# Altium schematic sheet Sensors.SchDoc: Sensors
size A4; DrawnBy: Alex Dyer; Revision: A; SheetNumber: 4; SheetTotal: 5
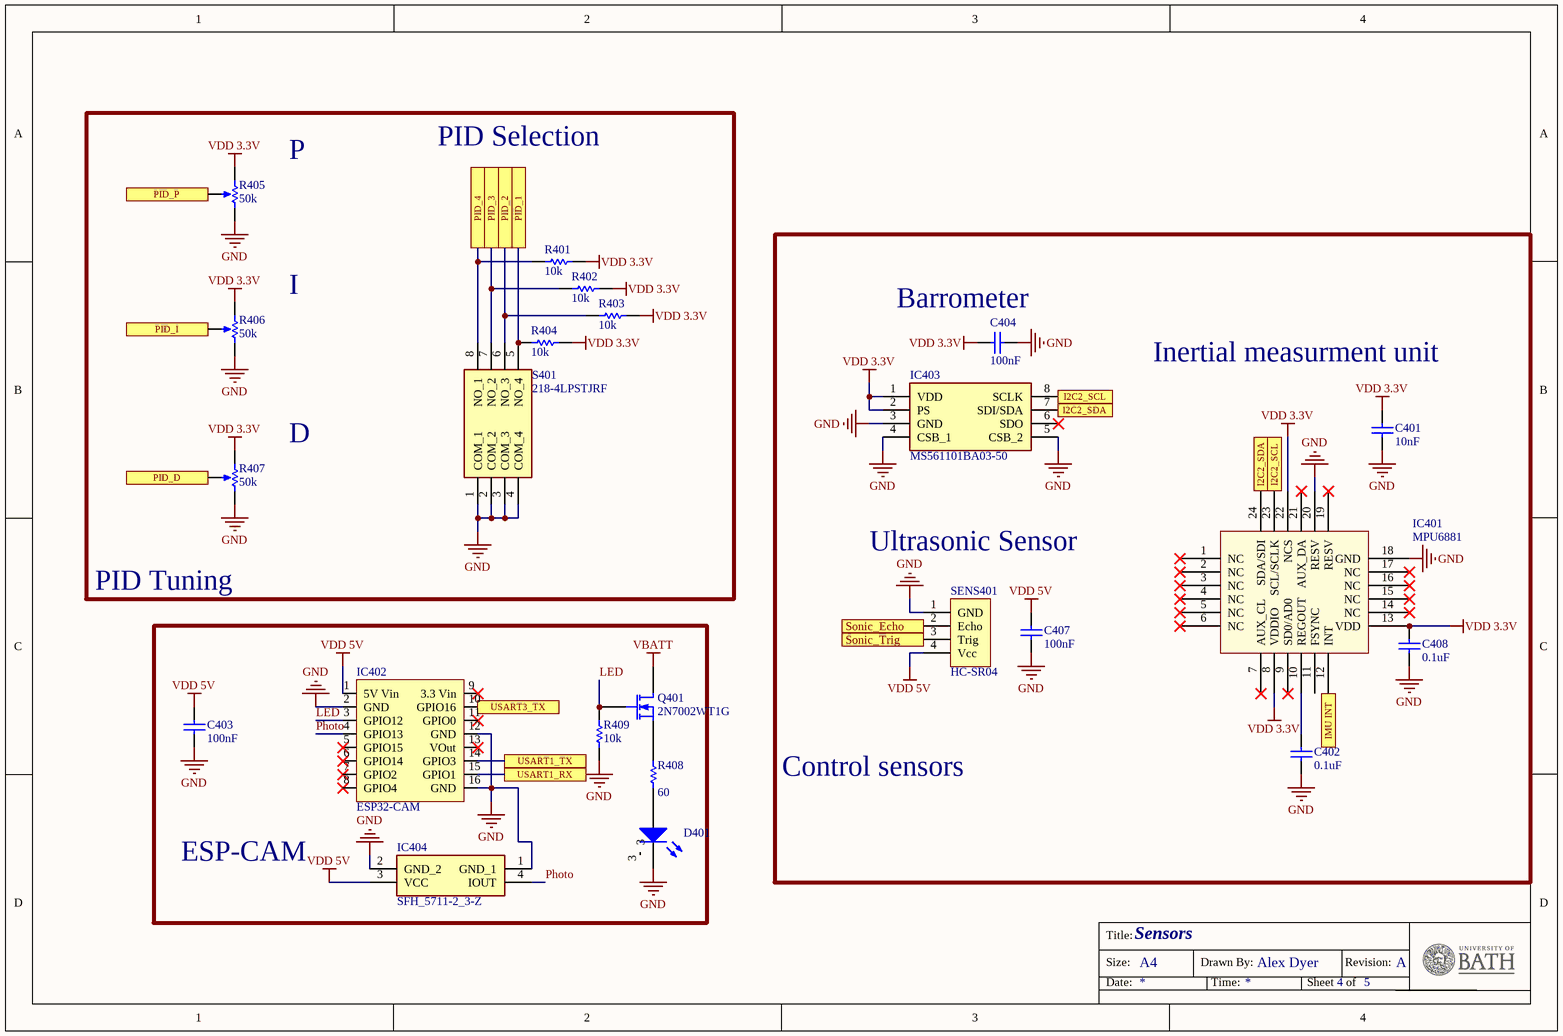
[diagram p0: Sensors.SchDoc]

## Parts
C401  value 10nF  [0805 Cap]  (hidden comment: Cap)
C402  value 0.1uF  [0805 Cap]  (hidden comment: Cap)
C403  value 100nF  [0805 Cap]  (hidden comment: Cap)
C404  value 100nF  [0805 Cap]  (hidden comment: Cap)
C407  value 100nF  [0805 Cap]  (hidden comment: Cap)
C408  value 0.1uF  [0805 Cap]  (hidden comment: Cap)
D401  XBDBLU-00-0000-000000201  [LED PAD]  (value not drawn)
IC401  MPU6881  [QFN40P300X300X105-25N-D]
IC402  ESP32-CAM  [ESP-CAM]
IC403  MS561101BA03-50  [MS561101BA03-50]
IC404  SFH_5711-2_3-Z  [SFH571123Z]
Q401  2N7002WT1G  [2N7002WT1G]
R401  value 10k  [0603]  (hidden comment: 0603)
R402  value 10k  [0603]  (hidden comment: 0603)
R403  value 10k  [0603]  (hidden comment: 0603)
R404  value 10k  [0603]  (hidden comment: 0603)
R405  value 50k  [TRIM_POT Bourns 3296]  (hidden comment: RPot)
R406  value 50k  [TRIM_POT Bourns 3296]  (hidden comment: RPot)
R407  value 50k  [TRIM_POT Bourns 3296]  (hidden comment: RPot)
R408  value 60  [RESC6432X65N]  (hidden comment: CRGH2512J68R)
R409  value 10k  [0603]  (hidden comment: 0603)
S401  218-4LPSTJRF  [2184LPSTJRF]
SENS401  HC-SR04  [B4B-XH-A]

## Blocks framed on the sheet
ESP-CAM: C403 D401 IC402 IC404 Q401 R408 R409

## Ports
I2C2_SCL, I2C2_SDA, IMU INT, PID_1, PID_2, PID_3, PID_4, PID_D, PID_I, PID_P, Sonic_Echo, Sonic_Trig, USART1_RX, USART1_TX, USART3_TX

## Nets
GND: C401.1 C402.1 C403.1 C404.1 C407.1 C408.1 D401.2(K) IC401.18(GND) IC401.20(RESV) IC402.2(GND) IC402.12(GND) IC402.16(GND) IC403.3(GND) IC403.4(CSB_1) IC403.5(CSB_2) IC404.1(GND_1) IC404.2(GND_2) R405.2(BOT) R406.2(BOT) R407.2(BOT) R409.2 S401.1(COM_1) S401.2(COM_2) S401.3(COM_3) S401.4(COM_4) SENS401.1(GND)
VBATT: Q401.1(D)
VDD 3.3V: C401.2 C404.2 C408.2 IC401.8(VDDIO) IC401.13(VDD) IC401.22(NCS) IC403.1(VDD) IC403.2(PS) R401.1 R402.1 R403.1 R404.1 R405.1(TOP) R406.1(TOP) R407.1(TOP)
VDD 5V: C403.2 C407.2 IC402.1(5V_Vin) IC404.3(VCC) SENS401.4(Vcc)
I2C2_SCL: IC401.23(SCL/SCLK) IC403.8(SCLK) ; port I2C2_SCL
I2C2_SDA: IC401.24(SDA/SDI) IC403.7(SDI/SDA) ; port I2C2_SDA
IMU INT: IC401.12(INT) ; port IMU INT
LED: IC402.3(GPIO12) Q401.2(G) R409.1
Photo: IC402.4(GPIO13) IC404.4(IOUT)
PID_1: R404.2 S401.5(NO_4) ; port PID_1
PID_2: R403.2 S401.6(NO_3) ; port PID_2
PID_3: R402.2 S401.7(NO_2) ; port PID_3
PID_4: R401.2 S401.8(NO_1) ; port PID_4
PID_D: R407.3(TAP) ; port PID_D
PID_I: R406.3(TAP) ; port PID_I
PID_P: R405.3(TAP) ; port PID_P
Sonic_Echo: SENS401.2(Echo) ; port Sonic_Echo
Sonic_Trig: SENS401.3(Trig) ; port Sonic_Trig
USART1_RX: IC402.15(GPIO1) ; port USART1_RX
USART1_TX: IC402.14(GPIO3) ; port USART1_TX
USART3_TX: IC402.10(GPIO16) ; port USART3_TX
NetC402_2: C402.2 IC401.10(REGOUT)
NetD401_1: D401.1(A) R408.1
NetQ401_3: Q401.3(S) R408.2

Not connected (* = marked no-connect by the designer): D401 3; IC401 1(NC)* 2(NC)* 3(NC)* 4(NC)* 5(NC)* 6(NC)* 7(AUX_CL)* 9(SD0/AD0)* 11(FSYNC) 14(NC)* 15(NC)* 16(NC)* 17(NC)* 19(RESV)* 21(AUX_DA)*; IC402 5(GPIO15)* 6(GPIO14)* 7(GPIO2)* 8(GPIO4)* 9(3.3_Vin)* 11(GPIO0)* 13(VOut)*; IC403 6(SDO)*

## Notes on the sheet
- P
- PID Selection
- I
- (near C404) Barrometer
- Inertial measurment unit
- D
- Ultrasonic Sensor
- PID Tuning
- Control sensors
- Title:
- Size:
- Date:
- A4
- Drawn By:
- Time:
- Sheet
- Revision:
- of

## Library data of the parts
C401 C403 C404 C407 = Cap: Capacitor; Published: 8-Jun-2000; LatestRevisionDate: 17-Jul-2002; LatestRevisionNote: Re-released for DXP Platform.; PackageReference: RAD-0.3; Publisher: Altium Limited; PackageDescription: Radial Cap, Thru-Hole; 2 Leads; 0.3 in Pin Spacing; ComponentLink1Description: Purchase; ComponentLink1URL: https://uk.rs-online.com/web/p/mlccs-multilayer-ceramic-capacitors/6480957/; Purchase: https://uk.rs-online.com/web/p/mlccs-multilayer-ceramic-capacitors/6480957/
C402 C408 = Cap: Low ESR Capacitor; Published: 8-Jun-2000; LatestRevisionDate: 17-Jul-2002; LatestRevisionNote: Re-released for DXP Platform.; PackageReference: RAD-0.3; Publisher: Altium Limited; PackageDescription: Radial Cap, Thru-Hole; 2 Leads; 0.3 in Pin Spacing; ComponentLink1Description: Purchase; ComponentLink1URL: https://uk.rs-online.com/web/p/mlccs-multilayer-ceramic-capacitors/7883048/; Purchase: https://uk.rs-online.com/web/p/mlccs-multilayer-ceramic-capacitors/7883048/
D401 = LED1: https://www.mouser.co.uk/ProductDetail/Cree-LED/XBDBLU-00-0000-000000201?qs=L2F6Qc639cBX0No8%252B6LF0A%3D%3D; Published: 8-Jun-2000; LatestRevisionDate: 08-Jul-2005; LatestRevisionNote: Mech Layer 1 removed.; PackageReference: LED-1; Publisher: Altium Limited; PackageDescription: LED; 2 Leads
IC401 = MPU6881: https://www.mouser.co.uk/ProductDetail/TDK-InvenSense/MPU-6881?qs=u4fy%2FsgLU9MthFpyRcZ0%252Bg%3D%3D
IC402 = ESP-CAM
IC403 = MS561101BA03-50: Integrated Circuit Note, Mouser Chepaer; Manufacturer_Name: TE Connectivity; Datasheet Link: https://componentsearchengine.com//MS561101BA03-50.pdf; Mouser2 Part Number: 824-MS561101BA03-50; Mouser2 Price/Stock: https://www.mouser.com/Search/Refine.aspx?Keyword=824-MS561101BA03-50; Manufacturer_Part_Number: MS561101BA03-50; ComponentLink1Description: Purchase; ComponentLink1URL: https://uk.rs-online.com/web/p/pressure-sensor-ics/8937130/; Purchase: https://uk.rs-online.com/web/p/pressure-sensor-ics/8937130/
IC404 = SFH_5711-2_3-Z: https://www.mouser.co.uk/ProductDetail/ams-OSRAM/SFH-5711-2-3-Z?qs=K5ta8V%252BWhtZqF99oIrrnNw%3D%3D; Manufacturer_Name: OSRAM; Manufacturer_Part_Number: SFH 5711-2/3-Z; Datasheet Link: https://dammedia.osram.info/media/resource/hires/osram-dam-2496447/SFH%205711.pdf; Height: 1.25mm; Mouser Part Number: 720-SFH5711-2/3-Z; Mouser Price/Stock: https://www.mouser.co.uk/ProductDetail/OSRAM-Opto-Semiconductors/SFH-5711-2-3-Z?qs=K5ta8V%252BWhtZqF99oIrrnNw%3D%3D
Q401 = MOSFET-N: https://www.mouser.co.uk/ProductDetail/ON-Semiconductor/2N7002WT1G?qs=%2Fha2pyFadujPTHSYx5%2FnTbaF5MlOOaLYuqobFODOT4c%3D; Catalogue No.: 863-2N7002WT1G; Published: 8-Jun-2000; LatestRevisionDate: 17-Jul-2002; LatestRevisionNote: Re-released for DXP Platform.; PackageVersion: 1995/1996; PackageReference: E3; Publisher: Altium Limited; PackageDescription: TO, Flat Index; 3 In-Line, Axial Leads; Body Dia. 4.6mm; Lead Dia. 0.5 mm (max)
R401-R404 R409 = Res1: Resistor; Published: 8-Jun-2000; LatestRevisionDate: 17-Jul-2002; LatestRevisionNote: Re-released for DXP Platform.; PackageReference: AXIAL-0.3; Publisher: Altium Limited; PackageDescription: Axial Device, Thru-Hole; 2 Leads; 0.3 in Pin Spacing; ComponentLink1Description: Purcahse; Purchase: https://uk.rs-online.com/web/p/surface-mount-fixed-resistors/9013601/
  R401 R402 R404: ComponentLink1URL: https://uk.rs-online.com/web/p/mlccs-multilayer-ceramic-capacitors/2644236/
  R403 R409: ComponentLink1URL: https://uk.rs-online.com/web/p/surface-mount-fixed-resistors/9013601/
R405-R407 = RPot: https://uk.rs-online.com/web/p/trimmer-resistors/5219805/; Sim Note: Enter the Resistance value and the set point into parameter fields.; Set Position: 0.5; Published: 8-Jun-2000; LatestRevisionDate: 17-Jul-2002; LatestRevisionNote: Re-released for DXP Platform.; PackageReference: VR5; Publisher: Altium Limited; PackageDescription: Variable Resistor, Thru-Hole; 3 Leads
R408 = Res1: https://www.mouser.co.uk/ProductDetail/TE-Connectivity-Holsworthy/CRGH2512J68R?qs=HLeXuo0aL2q34i8u56pcOQ%3D%3D; Published: 8-Jun-2000; LatestRevisionDate: 17-Jul-2002; LatestRevisionNote: Re-released for DXP Platform.; PackageReference: AXIAL-0.3; Publisher: Altium Limited; PackageDescription: Axial Device, Thru-Hole; 2 Leads; 0.3 in Pin Spacing
S401 = 218-4LPSTJRF: DIP Switches/SIP Switches SURFACE MOUNT, GOLD, HALF-PITCH DIP SWITCH, 4-POLE, LOW PROFILE ACTUATOR, BOTTOM SEAL, TAPE SEAL, J-BEND, REEL, OFF; Manufacturer_Name: CTS; Datasheet Link: https://www.ctscorp.com/wp-content/uploads/218.pdf; Height: 2.7mm; Manufacturer_Part_Number: 218-4LPSTJRF; Purchase: https://www.mouser.co.uk/ProductDetail/CTS-Electronic-Components/218-4LPSTJRF?qs=%2Fha2pyFadug5kYncPhJ9FkmRH7GTEiEUUQMrCssHcOgjfy8aTjLtCQ%3D%3D
SENS401 = Header 4: Ultrasonic Distance Sensor; LatestRevisionDate: 17-Jul-2002; LatestRevisionNote: Re-released for DXP Platform.; Publisher: Altium Limited; Purchase: https://www.sparkfun.com/products/15569; Parameter 1: *